# EAGLE design nixie_ctrl_board (EAGLE 7.5.0)
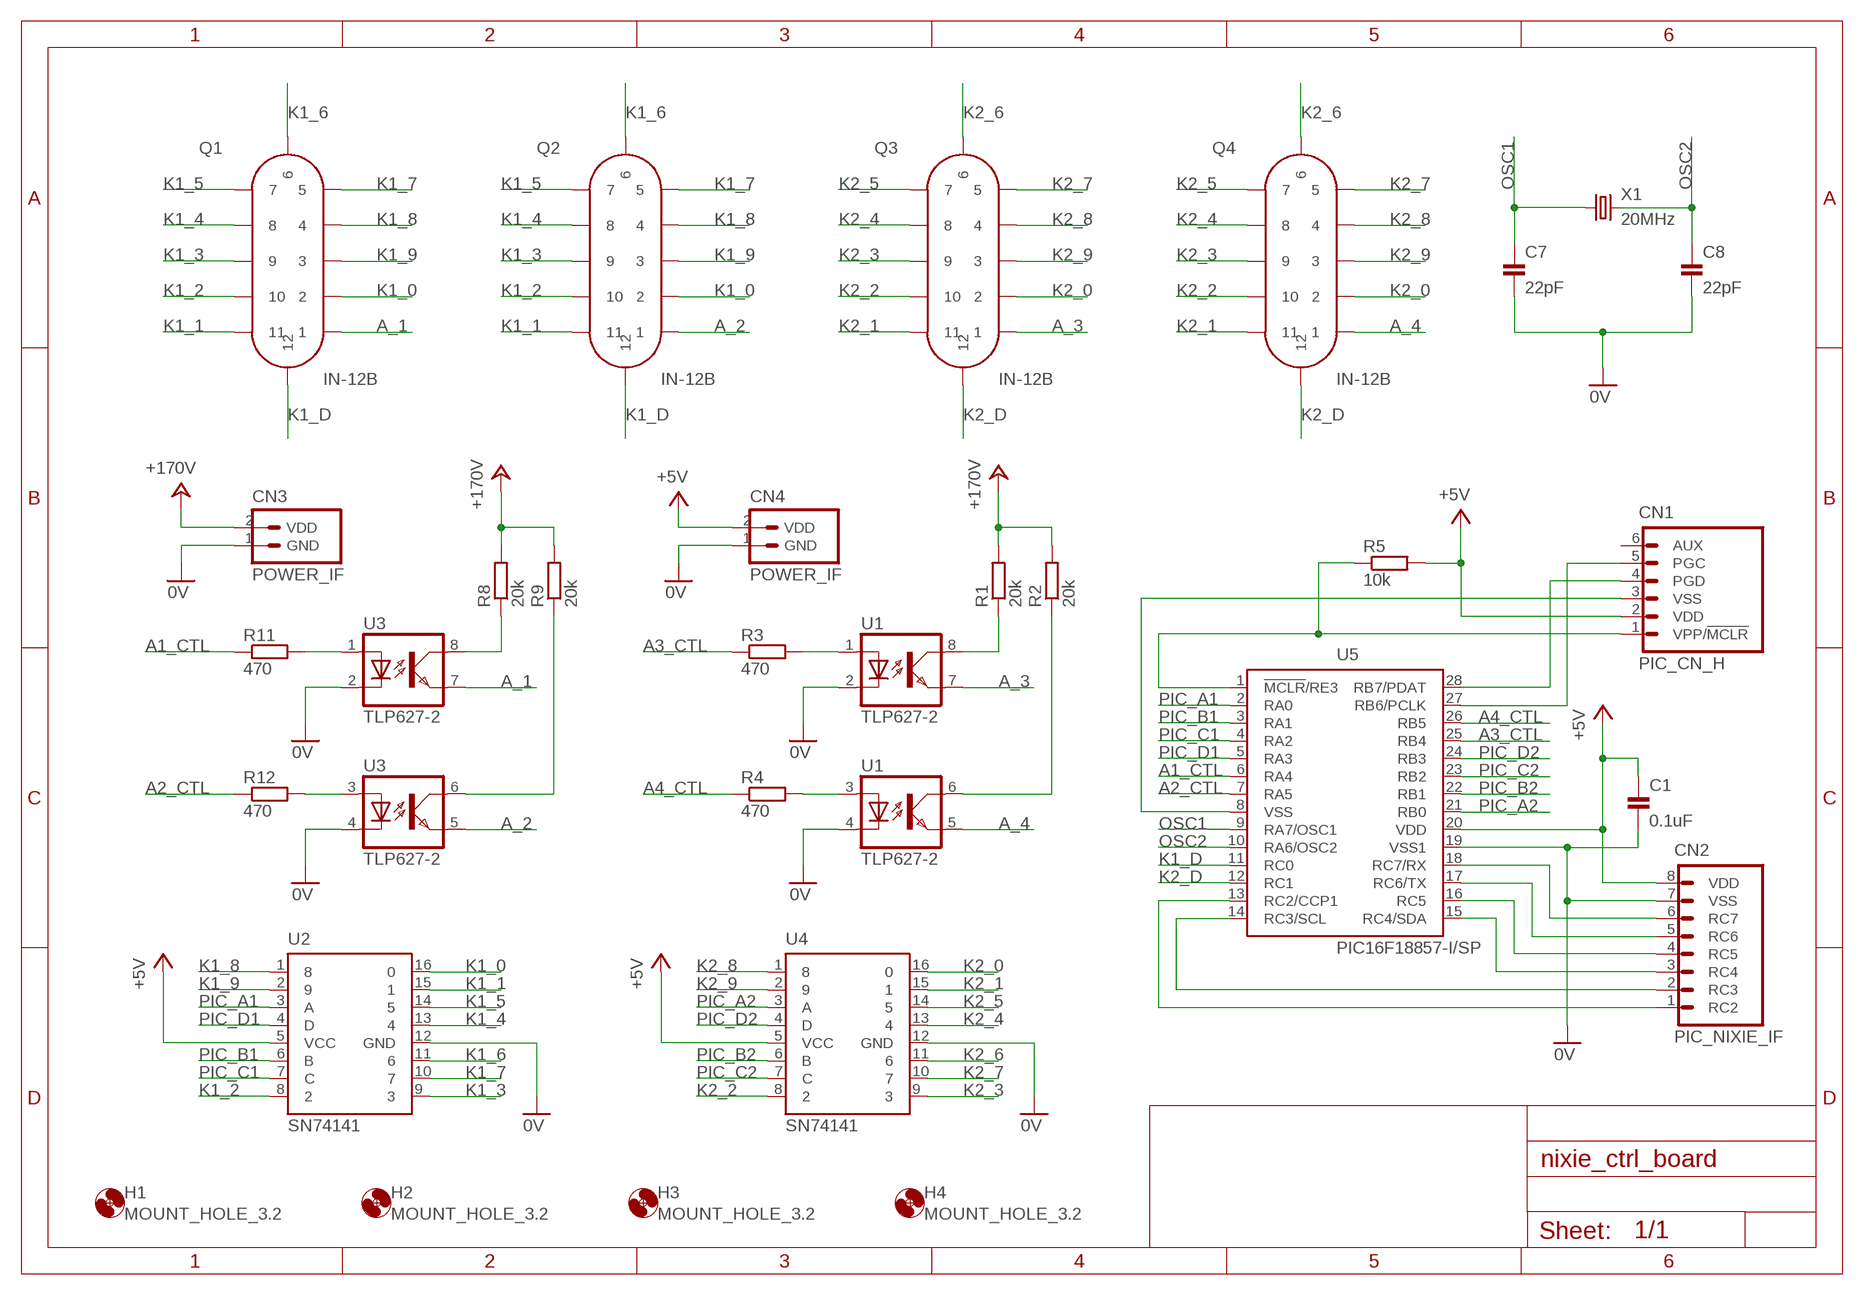
[diagram p0: schematic, sheet 1]

## Parts
C1  0.1uF  CAP_100MIL  [CAP_100MIL]
C7  22pF  CAP_100MIL  [CAP_100MIL]
C8  22pF  CAP_100MIL  [CAP_100MIL]
CN1  PIC_CN_H  [HEADER_6PIN]
CN2  PIC_NIXIE_IF  [PIC_IF_NIXIE_8PIN]
CN3  POWER_IF  [HEADER_2PIN_POWER_IF]
CN4  POWER_IF  [HEADER_2PIN_POWER_IF]
H1  MOUNT_HOLE_3.2  [3,2]
H2  MOUNT_HOLE_3.2  [3,2]
H3  MOUNT_HOLE_3.2  [3,2]
H4  MOUNT_HOLE_3.2  [3,2]
Q1  IN-12B  [IN-12]
Q2  IN-12B  [IN-12]
Q3  IN-12B  [IN-12]
Q4  IN-12B  [IN-12]
R1  20k  RESISTOR_300MIL  [RESISTOR_0207_300MIL]
R2  20k  RESISTOR_300MIL  [RESISTOR_0207_300MIL]
R3  470  RESISTOR_200MIL  [RESISTOR_0204_200MIL]
R4  470  RESISTOR_200MIL  [RESISTOR_0204_200MIL]
R5  10k  RESISTOR_200MIL  [RESISTOR_0204_200MIL]
R8  20k  RESISTOR_300MIL  [RESISTOR_0207_300MIL]
R9  20k  RESISTOR_300MIL  [RESISTOR_0207_300MIL]
R11  470  RESISTOR_200MIL  [RESISTOR_0204_200MIL]
R12  470  RESISTOR_200MIL  [RESISTOR_0204_200MIL]
U1  TLP627-2  [DIL08]
U2  SN74141  [DIL16]
U3  TLP627-2  [DIL08]
U4  SN74141  [DIL16]
U5  PIC16F18857-I/SP  [DIL28-3]
X1  20MHz  HUSG-20.000-20  [HC-49/S]

## Nets
0V: C1.2 C7.2 C8.2 CN2.7(VSS) CN3.1(GND) CN4.1(GND) U1.2(C) U1.4(C) U2.12(GND) U3.2(C) U3.4(C) U4.12(GND) U5.19(VSS1)
+5V: C1.1 CN1.2(VDD) CN2.8(VDD) CN4.2(VDD) R5.2 U2.5(VCC) U4.5(VCC) U5.20(VDD)
+24V: CN3.2(VDD) R1.2 R2.2 R8.2 R9.2 ; supply symbol labelled +170V
A1_CTL: R11.1 U5.6(RA4)
A2_CTL: R12.1 U5.7(RA5)
A3_CTL: R3.1 U5.25(RB4)
A4_CTL: R4.1 U5.26(RB5)
A_1: Q1.1 U3.7(EMIT)
A_2: Q2.1 U3.5(EMIT)
A_3: Q3.1 U1.7(EMIT)
A_4: Q4.1 U1.5(EMIT)
K1_0: Q1.2 Q2.2 U2.16
K1_1: Q1.11 Q2.11 U2.15
K1_2: Q1.10 Q2.10 U2.8
K1_3: Q1.9 Q2.9 U2.9
K1_4: Q1.8 Q2.8 U2.13
K1_5: Q1.7 Q2.7 U2.14
K1_6: Q1.6 Q2.6 U2.11
K1_7: Q1.5 Q2.5 U2.10
K1_8: Q1.4 Q2.4 U2.1
K1_9: Q1.3 Q2.3 U2.2
K1_D: Q1.12 Q2.12 U5.11(RC0)
K2_0: Q3.2 Q4.2 U4.16
K2_1: Q3.11 Q4.11 U4.15
K2_2: Q3.10 Q4.10 U4.8
K2_3: Q3.9 Q4.9 U4.9
K2_4: Q3.8 Q4.8 U4.13
K2_5: Q3.7 Q4.7 U4.14
K2_6: Q3.6 Q4.6 U4.11
K2_7: Q3.5 Q4.5 U4.10
K2_8: Q3.4 Q4.4 U4.1
K2_9: Q3.3 Q4.3 U4.2
K2_D: Q3.12 Q4.12 U5.12(RC1)
N$1: R1.1 U1.8(COL)
N$2: R2.1 U1.6(COL)
N$3: R3.2 U1.1(A)
N$4: R4.2 U1.3(A)
N$5: CN2.6(RC7) U5.18(RC7/RX)
N$6: CN2.5(RC6) U5.17(RC6/TX)
N$7: CN1.1(VPP/!MCLR) R5.1 U5.1(!MCLR!/RE3)
N$8: CN1.4(PGD) U5.28(RB7/PDAT)
N$9: CN1.5(PGC) U5.27(RB6/PCLK)
N$10: CN2.4(RC5) U5.16(RC5)
N$11: R8.1 U3.8(COL)
N$12: R9.1 U3.6(COL)
N$13: R11.2 U3.1(A)
N$14: R12.2 U3.3(A)
N$15: CN1.3(VSS) U5.8(VSS)
N$16: CN2.3(RC4) U5.15(RC4/SDA)
N$17: CN2.2(RC3) U5.14(RC3/SCL)
N$18: CN2.1(RC2) U5.13(RC2/CCP1)
OSC1: C7.1 U5.9(RA7/OSC1) X1.1
OSC2: C8.1 U5.10(RA6/OSC2) X1.2
PIC_A1: U2.3(A) U5.2(RA0)
PIC_A2: U4.3(A) U5.21(RB0)
PIC_B1: U2.6(B) U5.3(RA1)
PIC_B2: U4.6(B) U5.22(RB1)
PIC_C1: U2.7(C) U5.4(RA2)
PIC_C2: U4.7(C) U5.23(RB2)
PIC_D1: U2.4(D) U5.5(RA3)
PIC_D2: U4.4(D) U5.24(RB3)
Unconnected: CN1.6(AUX)

## Library data of the parts
C1 C7 C8 = Parts:CAP: コンデンサー
CN1 = Connectors:PIC_CN: PICKit 3 インターフェースピン
CN2 = PartsForProto:PIC_NIXIE_IF: PIC GPIO インターフェース
CN3 CN4 = PartsForProto:POWER_IF: 電源供給インターフェース
H1-H4 = Generic:MOUNT_HOLE; OC_NEWARK: unknown
Q1-Q4 = Parts:IN-12*: ニキシー管; OC_NEWARK: unknown
R1-R5 R8 R9 R11 R12 = Parts:RESISTOR: 抵抗器
U1 U3 = Parts:TLP627*: ２回路入フォトカプラ TLP627-2 ・パッケージ：８ピンＤＩＰ ・ＩＣ：１５０ｍＡ ・変換効率：４０００％ ｔｙｐ． ・動作温度：－５５℃～１００℃ ・絶縁耐圧：５０００Ｖｒｍｓ ｍｉｎ．（＠６０ｓｅｃ）
U2 U4 = Parts:SN74141: BCD-TO-DECIMAL DECORDER/DRIVER
U5 = Parts:PIC16F18857*: Full-Featured 28-Pin Microcontrollers ・プログラムメモリ：３２７６８ワード ・ＥＥＰＲＯＭ：２５６バイト ・データＳＲＡＭ：４０９６バイト ・Ｉ／Ｏ：最大２５ ・動作クロック：３２ＭＨｚ（最大） ・電源電圧：２．３Ｖ～５．５Ｖ ・２８ピンＤＩＰパッケージ
X1 = Parts:HUSG-*: クリスタル（水晶発振子） 小型のＨＣ－４９／Ｓ型パッケージです。 ・２０ＭＨｚ ・負荷容量：２０ｐＦ ・周波数偏差：±３０ｐｐｍ（２５℃）

## Board
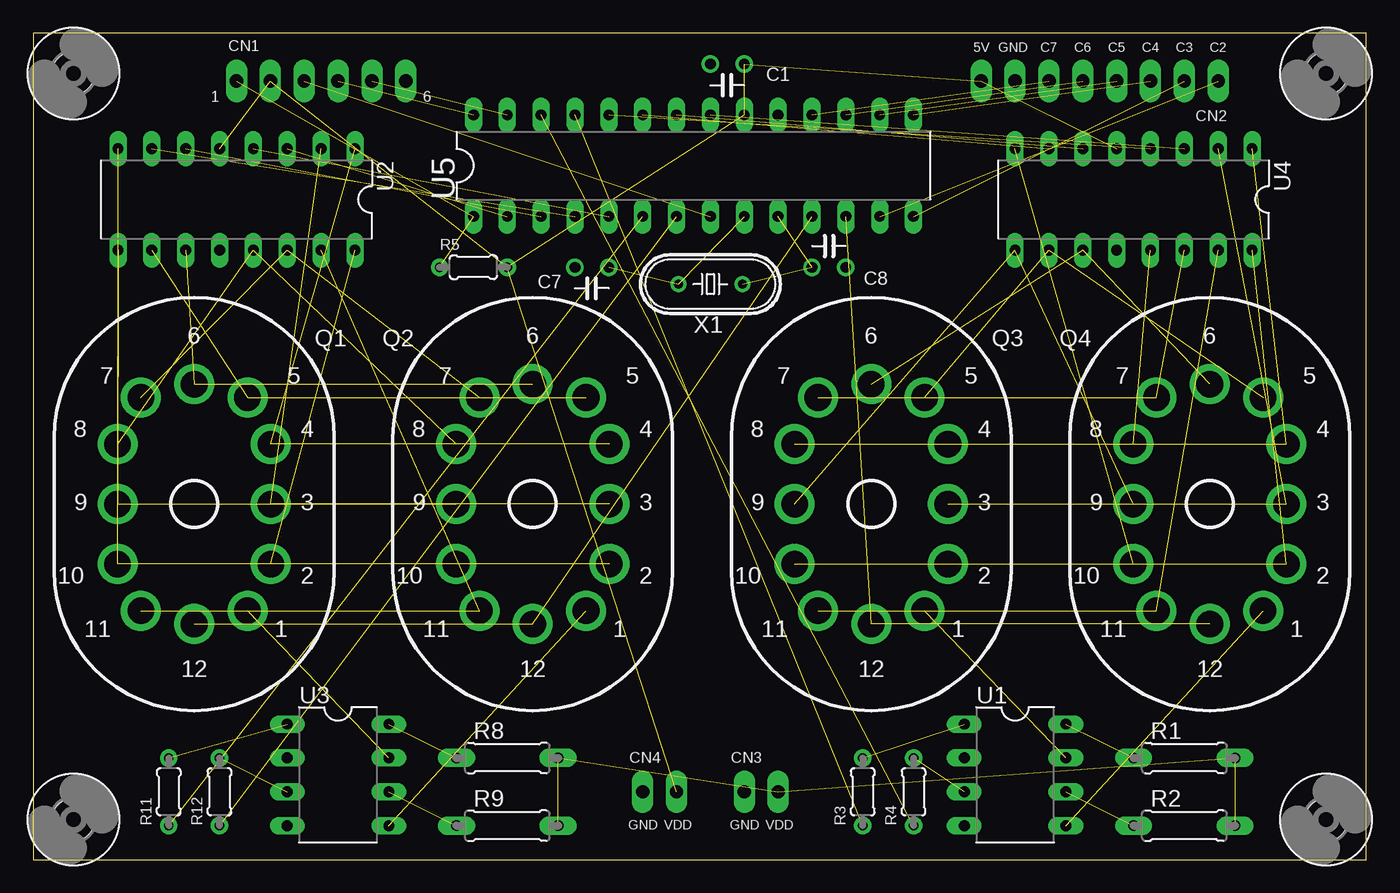
[diagram p1: board, top side]
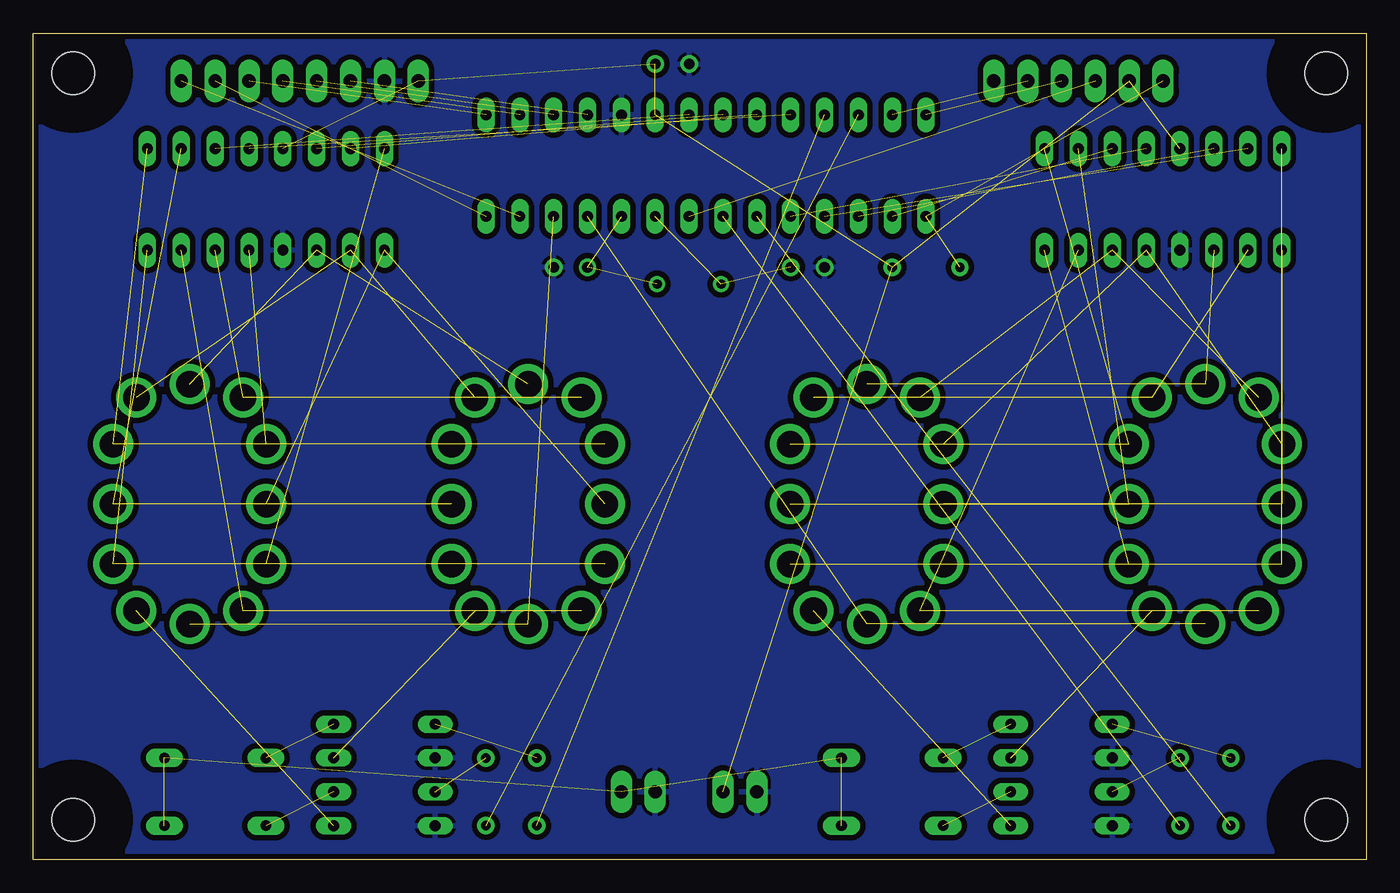
[diagram p2: board, bottom side, seen from below]

Size 100 x 62 mm. Coordinates in mm from the lower left corner, seen from the top.
Outline: 0,0 100,0 100,62 0,62 0,0
Copper layers (1*16): Top 0.035mm / dielectric 1.5mm / Bottom 0.035mm
Design rules "SeeedStudio_2layer_DRU_no_angle_20140221": minimum track width 6mil, minimum drill 12mil, track to track 6mil, track to pad 6mil, pad to pad 6mil, via to via 6mil, smd to smd 0mil, copper to edge 10mil, drill to drill 10mil, minimum pad ring 10mil, minimum via ring 6mil, stop-mask expansion 2mil, vias tented up to drill 100mil, thermal gap 10mil

### Footprints (pad centres in the part's own frame; a part is rotated, then mirrored left to right if it is on the bottom)
CAP_100MIL = drill 0.8: 1 -1.27,0; 2 1.27,0
HEADER_6PIN = drill 1 pad 1.6 long: 1 0,0; 2 2.54,0; 3 5.08,0; 4 7.62,0; 5 10.16,0; 6 12.7,0
PIC_IF_NIXIE_8PIN = drill 1 pad 1.6 long: 1 0,0; 2 2.54,0; 3 5.08,0; 4 7.62,0; 5 10.16,0; 6 12.7,0; 7 15.24,0; 8 17.78,0
HEADER_2PIN_POWER_IF = drill 1 pad 1.6 long: 1 0,0; 2 2.54,0
3,2 = hole 3.2: 0,0
IN-12 = drill 2: 1 4,-8; 2 5.75,-4.5; 3 5.75,0; 4 5.75,4.5; 5 4,8; 6 0,9; 7 -4,8; 8 -5.75,4.5; 9 -5.75,0; 10 -5.75,-4.5; 11 -4,-8; 12 0,-9
RESISTOR_0207_300MIL = drill 0.8 pad 1.4 long: 1 0,0; 2 7.62,0
RESISTOR_0204_200MIL = drill 0.7 pad 1.3: 1 -2.54,0; 2 2.54,0
DIL08 = drill 0.813 long: 1 -3.81,-3.81; 2 -1.27,-3.81; 3 1.27,-3.81; 4 3.81,-3.81; 5 3.81,3.81; 6 1.27,3.81; 7 -1.27,3.81; 8 -3.81,3.81
DIL16 = drill 0.813 long: 1 -8.89,-3.81; 2 -6.35,-3.81; 3 -3.81,-3.81; 4 -1.27,-3.81; 5 1.27,-3.81; 6 3.81,-3.81; 7 6.35,-3.81; 8 8.89,-3.81; 9 8.89,3.81; 10 6.35,3.81; 11 3.81,3.81; 12 1.27,3.81; 13 -1.27,3.81; 14 -3.81,3.81; 15 -6.35,3.81; 16 -8.89,3.81
DIL28-3 = drill 0.813 long: 1 -16.51,-3.81; 2 -13.97,-3.81; 3 -11.43,-3.81; 4 -8.89,-3.81; 5 -6.35,-3.81; 6 -3.81,-3.81; 7 -1.27,-3.81; 8 1.27,-3.81; 9 3.81,-3.81; 10 6.35,-3.81; 11 8.89,-3.81; 12 11.43,-3.81; 13 13.97,-3.81; 14 16.51,-3.81; 15 16.51,3.81; 16 13.97,3.81; 17 11.43,3.81; 18 8.89,3.81; 19 6.35,3.81; 20 3.81,3.81; 21 1.27,3.81; 22 -1.27,3.81; 23 -3.81,3.81; 24 -6.35,3.81; 25 -8.89,3.81; 26 -11.43,3.81; 27 -13.97,3.81; 28 -16.51,3.81
HC-49/S = drill 0.7: 1 -2.4,0; 2 2.4,0

### Placement (x,y rotation side)
C1  52.07,59.69 180 top
C7  41.91,44.45 180 top
C8  59.69,44.45 0 top
CN1  15.24,58.42 0 top
CN2  88.9,58.42 180 top
CN3  53.34,5.08 0 top
CN4  45.72,5.08 0 top
H1  97,3 0 top
H2  3,59 0 top
H3  97,59 0 top
H4  3,3 0 top
Q1  12.06,26.67 0 top
Q2  37.47,26.67 0 top
Q3  62.87,26.67 0 top
Q4  88.27,26.67 0 top
R1  82.55,7.62 0 top
R2  82.55,2.54 0 top
R3  62.23,5.08 90 top
R4  66.04,5.08 90 top
R5  33.02,44.45 0 top
R8  31.75,7.62 0 top
R9  31.75,2.54 0 top
R11  10.16,5.08 90 top
R12  13.97,5.08 90 top
U1  73.66,6.35 270 top
U2  15.24,49.53 180 top
U3  22.86,6.35 270 top
U4  82.55,49.53 180 top
U5  49.53,52.07 0 top
X1  50.8,43.18 0 top

### Tracks (layer width: path | path; a pad name or v marks a point on that pad's centre or on a via)
0V
  pour Bottom (isolate 0.406, rank 3): -3.81,63.5 104.14,63.5 104.14,-1.27 -3.81,-1.27
+5V  (7 unrouted)
+24V  (4 unrouted)
A1_CTL  (1 unrouted)
A2_CTL  (1 unrouted)
A3_CTL  (1 unrouted)
A4_CTL  (1 unrouted)
A_1  (1 unrouted)
A_2  (1 unrouted)
A_3  (1 unrouted)
A_4  (1 unrouted)
K1_0  (2 unrouted)
K1_1  (2 unrouted)
K1_2  (2 unrouted)
K1_3  (2 unrouted)
K1_4  (2 unrouted)
K1_5  (2 unrouted)
K1_6  (2 unrouted)
K1_7  (2 unrouted)
K1_8  (2 unrouted)
K1_9  (2 unrouted)
K1_D  (2 unrouted)
K2_0  (2 unrouted)
K2_1  (2 unrouted)
K2_2  (2 unrouted)
K2_3  (2 unrouted)
K2_4  (2 unrouted)
K2_5  (2 unrouted)
K2_6  (2 unrouted)
K2_7  (2 unrouted)
K2_8  (2 unrouted)
K2_9  (2 unrouted)
K2_D  (2 unrouted)
N$1  (1 unrouted)
N$2  (1 unrouted)
N$3  (1 unrouted)
N$4  (1 unrouted)
N$5  (1 unrouted)
N$6  (1 unrouted)
N$7  (2 unrouted)
N$8  (1 unrouted)
N$9  (1 unrouted)
N$10  (1 unrouted)
N$11  (1 unrouted)
N$12  (1 unrouted)
N$13  (1 unrouted)
N$14  (1 unrouted)
N$15  (1 unrouted)
N$16  (1 unrouted)
N$17  (1 unrouted)
N$18  (1 unrouted)
OSC1  (2 unrouted)
OSC2  (2 unrouted)
PIC_A1  (1 unrouted)
PIC_A2  (1 unrouted)
PIC_B1  (1 unrouted)
PIC_B2  (1 unrouted)
PIC_C1  (1 unrouted)
PIC_C2  (1 unrouted)
PIC_D1  (1 unrouted)
PIC_D2  (1 unrouted)